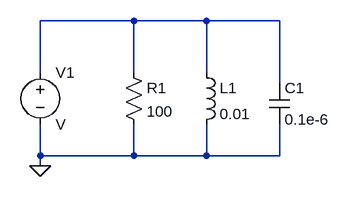
[diagram p0: schematic parallel_rlc.asc]
parallel_rlc.asc, the LTspice schematic file:
Version 4
SHEET 1 880 680
WIRE 224 48 80 48
WIRE 336 48 224 48
WIRE 448 48 336 48
WIRE 80 128 80 48
WIRE 224 128 224 48
WIRE 336 128 336 48
WIRE 448 144 448 48
WIRE 80 256 80 208
WIRE 224 256 224 208
WIRE 224 256 80 256
WIRE 336 256 336 208
WIRE 336 256 224 256
WIRE 448 256 448 208
WIRE 448 256 336 256
WIRE 80 272 80 256
FLAG 80 272 0
SYMBOL voltage 80 112 R0
SYMATTR InstName V1
SYMBOL res 208 112 R0
SYMATTR InstName R1
SYMATTR Value 100
SYMBOL ind 320 112 R0
SYMATTR InstName L1
SYMATTR Value 0.01
SYMBOL cap 432 144 R0
SYMATTR InstName C1
SYMATTR Value 0.1e-6

The netlist it stands for:
* parallel_rlc.asc
V1 N001 0 V
R1 N001 0 100
L1 N001 0 0.01
C1 N001 0 0.1e-6
.backanno
.end